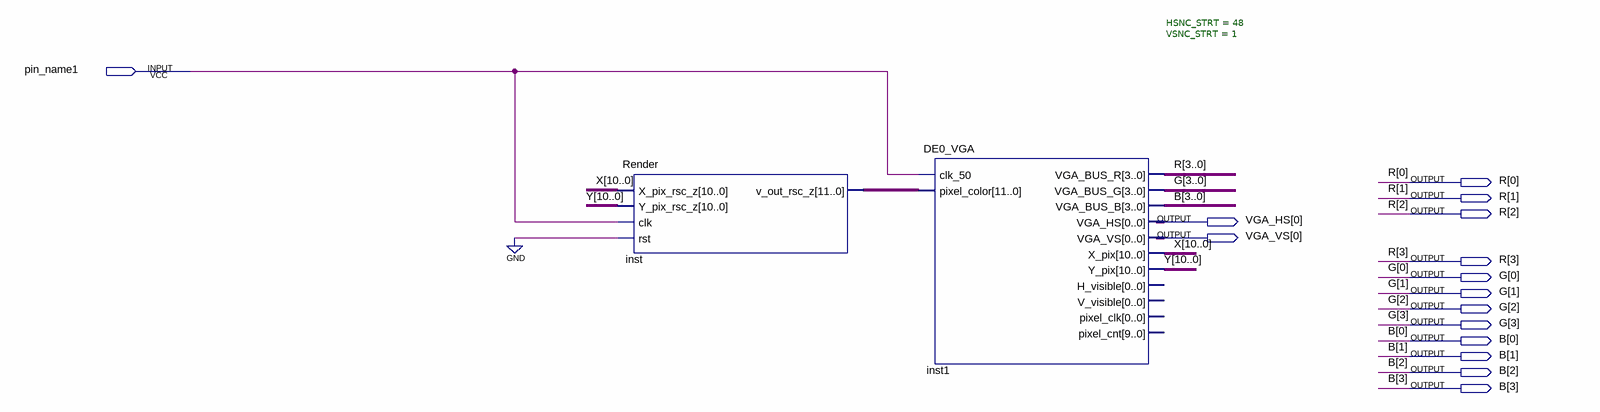
[diagram p0: schematic sheet]
// Quartus schematic quartus.bdf as structural Verilog: 2 symbols, 15 pins
module quartus (
  input  pin_name1,
  output [3:0] R,
  output [0:0] VGA_HS,
  output [0:0] VGA_VS,
  output [3:0] G,
  output [3:0] B
);

  wire [10:0] X, Y;
  wire [11:0] inst_v_out_rsc_z;

  Render inst (.X_pix_rsc_z(X), .Y_pix_rsc_z(Y), .clk(pin_name1), .rst(1'b0), .v_out_rsc_z(inst_v_out_rsc_z));
  DE0_VGA #(.HSNC_STRT(48), .VSNC_STRT(1)) inst1 (
    .clk_50(pin_name1), .pixel_color(inst_v_out_rsc_z), .VGA_BUS_R(R), .VGA_BUS_G(G), .VGA_BUS_B(B),
    .VGA_HS(VGA_HS[0]), .VGA_VS(VGA_VS[0]), .X_pix(X), .Y_pix(Y));  // open: H_visible, V_visible, pixel_clk, pixel_cnt
endmodule
